# Altium schematic sheet mke04_heatGun.SchDoc
size A4
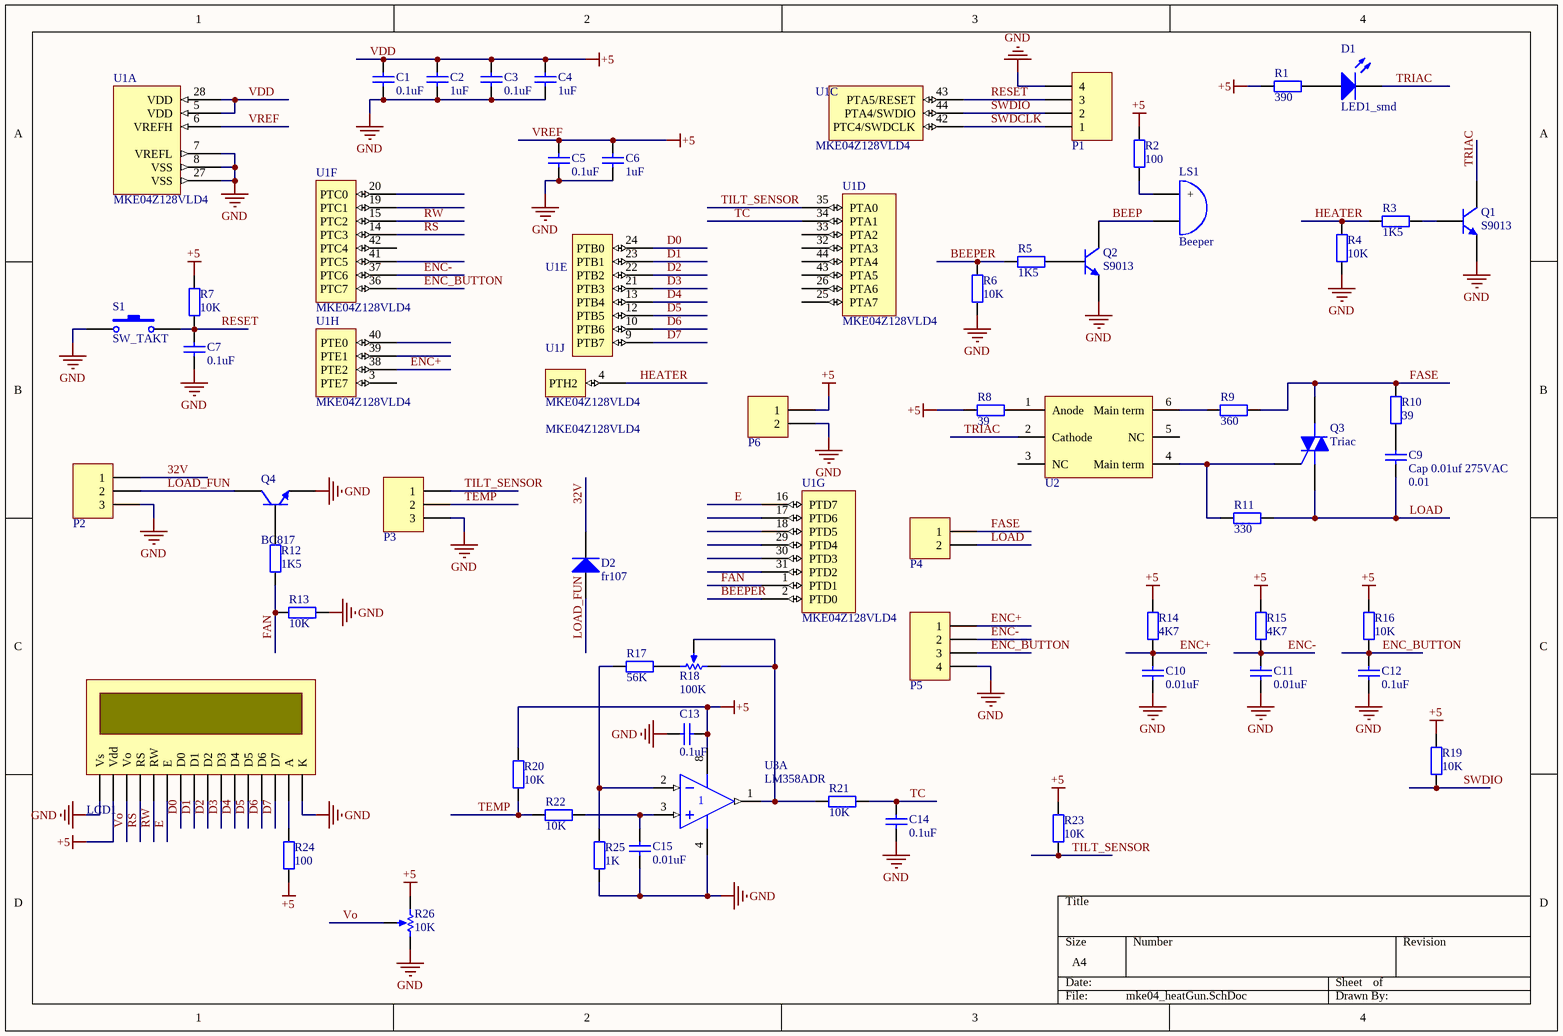
[diagram p0: mke04_heatGun.SchDoc]

## Parts
C1  value 0.1uF  [0805_C]  (hidden comment: Cap 0.1uf)
C2  value 1uF  [0805_C]  (hidden comment: Cap 1uf)
C3  value 0.1uF  [0805_C]  (hidden comment: Cap 0.1uf)
C4  value 1uF  [0805_C]  (hidden comment: Cap 1uf)
C5  value 0.1uF  [0805_C]  (hidden comment: Cap 0.1uf)
C6  value 1uF  [0805_C]  (hidden comment: Cap 1uf)
C7  value 0.1uF  [0805_C]  (hidden comment: Cap 0.1uf)
C9  Cap 0.01uf 275VAC  value 0.01  [CAPR1000-500X1300X1100]
C10  value 0.01uF  [0805_C]  (hidden comment: Cap 0.01uf)
C11  value 0.01uF  [0805_C]  (hidden comment: Cap 0.01uf)
C12  value 0.1uF  [0805_C]  (hidden comment: Cap 0.1uf)
C13  value 0.1uF  [0805_C]  (hidden comment: Cap 0.1uf)
C14  value 0.1uF  [0805_C]  (hidden comment: Cap 0.1uf)
C15  value 0.01uF  [0805_C]  (hidden comment: Cap 0.01uf)
D1  LED1_smd  [0805_R]
D2  fr107  [DO-41]
LCD1  LCD1602  [LCD1602]  (value not drawn)
LS1  Beeper  [Beeper]
P1  Pin header 4  [Pin_header_4P_2.54_M]  (value not drawn)
P2  Pin header 3  [PHOENIX_1715734]  (value not drawn)
P3  Pin header 3  [PHOENIX_1715734]  (value not drawn)
P4  Pin header 2  [PIN_HEADER_2_5.08]  (value not drawn)
P5  Pin header 4  [Pin_header_4P_2.54_M]  (value not drawn)
P6  Pin header 2  [PIN_HEADER_2_5.08]  (value not drawn)
Q1  S9013  [SOT23]
Q2  S9013  [SOT23]
Q3  Triac  [TO-220-v]
Q4  BC817  [SOT23]
R1  value 390  [0805_R]  (hidden comment: Res 390)
R2  value 100  [1206_R]  (hidden comment: Res 100)
R3  value 1K5  [0805_R]  (hidden comment: Res 1K5)
R4  value 10K  [0805_R]  (hidden comment: Res 10K)
R5  value 1K5  [0805_R]  (hidden comment: Res 1K5)
R6  value 10K  [0805_R]  (hidden comment: Res 10K)
R7  value 10K  [0805_R]  (hidden comment: Res 10K)
R8  value 39  [1206_R]  (hidden comment: Res 39)
R9  value 360  [2512_S]  (hidden comment: Res 360)
R10  value 39  [2512_S]  (hidden comment: Res 39)
R11  value 330  [2512_S]  (hidden comment: Res 330)
R12  value 1K5  [0805_R]  (hidden comment: Res 1K5)
R13  value 10K  [0805_R]  (hidden comment: Res 10K)
R14  value 4K7  [0805_R]  (hidden comment: Res 4K7)
R15  value 4K7  [0805_R]  (hidden comment: Res 4K7)
R16  value 10K  [0805_R]  (hidden comment: Res 10K)
R17  value 56K  [1206_R]  (hidden comment: Res 56K)
R18  value 100K  [TRIM_BOURNS_3266W]  (hidden comment: RPot_100k)
R19  value 10K  [0805_R]  (hidden comment: Res 10K)
R20  value 10K  [0805_R]  (hidden comment: Res 10K)
R21  value 10K  [0805_R]  (hidden comment: Res 10K)
R22  value 10K  [0805_R]  (hidden comment: Res 10K)
R23  value 10K  [0805_R]  (hidden comment: Res 10K)
R24  value 100  [1206_R]  (hidden comment: Res 100)
R25  value 1K  [1206_R]  (hidden comment: Res 1K)
R26  value 10K  [TRIM_BOURNS_3266W]  (hidden comment: RPot_10k)
S1  SW_TAKT  [TAKT-KEY]
U1  MKE04Z128VLD4  [QFP80P1390X1390X245-44N]  (parts A,C,D,E,F,G,H,J of 10)
U2  MOC3041  [DIP6-300]  (value not drawn)
U3  LM358ADR  [SOIC127_8]  (part A of 2)

## Nets
GND: C1.1 C2.1 C3.1 C4.1 C5.1 C6.1 C7.1 C10.1 C11.1 C12.1 C13.2 C14.2 C15.1 LCD1.1(Vs) LCD1.16(K) P1.4 P2.3 P3.3 P5.4 P6.2 Q1.2(E) Q2.2(E) Q4.2(E) R4.1 R6.1 R13.1 R25.1 R26.3(BOT) S1.1 U1.7(VREFL) U1.8(VSS) U1.27(VSS) U3.4(V-)
VDD: C1.2 C2.2 C3.2 C4.2 C5.2 C6.2 C13.1 LCD1.2(Vdd) P6.1 R1.2 R2.2 R7.2 R8.1 R14.2 R15.2 R16.2 R19.2 R20.1 R23.2 R24.1 R26.1(TOP) U1.5(VDD) U1.6(VREFH) U1.28(VDD) U3.8(V+)  [also labelled +5, VREF]
32V: D2.1(K) P2.1
BEEP: LS1.2(B) Q2.3(C)
BEEPER: R5.1 R6.2 U1.2(PTD0)
D0: LCD1.7(D0) U1.24(PTB0)
D1: LCD1.8(D1) U1.23(PTB1)
D2: LCD1.9(D2) U1.22(PTB2)
D3: LCD1.10(D3) U1.21(PTB3)
D4: LCD1.11(D4) U1.13(PTB4)
D5: LCD1.12(D5) U1.12(PTB5)
D6: LCD1.13(D6) U1.10(PTB6)
D7: LCD1.14(D7) U1.9(PTB7)
E: LCD1.6(E) U1.16(PTD7)
ENC+: C10.2 P5.1 R14.1 U1.38(PTE2)
ENC-: C11.2 P5.2 R15.1 U1.37(PTC6)
ENC_BUTTON: C12.2 P5.3 R16.1 U1.36(PTC7)
FAN: R12.1 R13.2 U1.1(PTD1)
FASE: P4.1 Q3.2(A2) R9.2 R10.2
HEATER: R3.1 R4.2 U1.4(PTH2)
LOAD: C9.1 P4.2 Q3.1(A1) R11.2
LOAD_FUN: D2.2(A) P2.2 Q4.3(C)
RESET: C7.2 P1.3 R7.1 S1.2 U1.43(PTA5/RESET)
RS: LCD1.4(RS) U1.14(PTC3)
RW: LCD1.5(RW) U1.15(PTC2)
SWDCLK: P1.1 U1.42(PTC4/SWDCLK)
SWDIO: P1.2 R19.1 U1.44(PTA4/SWDIO)
TC: C14.1 R21.1 U1.34(PTA1)
TEMP: P3.2 R20.2 R22.2
TILT_SENSOR: P3.1 R23.1 U1.35(PTA0)
TRIAC: D1.2(K) Q1.3(C) U2.2(Cathode)
Vo: LCD1.3(Vo) R26.2(TAP)
NetC9_2: C9.2 R10.1
NetC15_2: C15.2 R22.1 U3.3(IN+)
NetD1_1: D1.1(A) R1.1
NetLCD1_15: LCD1.15(A) R24.2
NetLS1_1: LS1.1(+) R2.1
NetQ1_1: Q1.1(B) R3.2
NetQ2_1: Q2.1(B) R5.2
NetQ3_3: Q3.3(G) R11.1 U2.4(Main_term)
NetQ4_1: Q4.1(B) R12.2
NetR8_2: R8.2 U2.1(Anode)
NetR9_1: R9.1 U2.6(Main_term)
NetR17_1: R17.1 R25.2 U3.2(IN-)
NetR17_2: R17.2 R18.3(BOT)
NetR18_1: R18.1(TOP) R18.2(TAP) R21.2 U3.1(OUT)

Not connected (* = marked no-connect by the designer): U1 3(PTE7) 17(PTD6) 18(PTD5) 19(PTC1) 20(PTC0) 25(PTA7) 26(PTA6) 29(PTD4) 30(PTD3) 31(PTD2) 32(PTA3) 33(PTA2) 39(PTE1) 40(PTE0) 41(PTC5); U2 3(NC) 5(NC)

## Library data of the parts
C9 = Cap 0.01uf 275VAC: Capacitor; Published: 8-Jun-2000; LatestRevisionDate: 17-Jul-2002; LatestRevisionNote: Re-released for DXP Platform.; PackageReference: RAD-0.3; Publisher: Altium Limited; PackageDescription: Radial Cap, Thru-Hole; 2 Leads; 0.3 in Pin Spacing
D1 = LED1_smd: Typical RED GaAs LED; Published: 8-Jun-2000; LatestRevisionDate: 08-Jul-2005; LatestRevisionNote: Mech Layer 1 removed.; PackageReference: LED-1; Publisher: Altium Limited; PackageDescription: LED; 2 Leads
D2 = fr107: 1 Amp Impulse diode; Published: 8-Jun-2000; LatestRevisionDate: 17-Jul-2002; LatestRevisionNote: Re-released for DXP Platform.; DatasheetVersion: 1998; PackageVersion: Aug-1999; PackageReference: DO-201AD; Publisher: Altium Limited; PackageDescription: Diode, Axial; Body 9.5 x 5.6 mm (LxDia. max), Lead Dia. 1.32 mm (max); ComponentLink1Description: Manufacturer Link; ComponentLink1URL: http://www.fairchildsemi.com/; ComponentLink2Description: Datasheet; ComponentLink2URL: http://www.fairchildsemi.com/ds/1N%2F1N5400.pdf
LCD1 = LCD1602: Display; Published: 24-Mar-1999; LatestRevisionDate: 29-May-2009; LatestRevisionNote: IPC-7351 Footprint Added.; PackageReference: D2PAK; Publisher: Altium Limited; PackageDescription: 3-Pin Transistor Outline Package 2.54 mm Pitch, 15.1 mm Lead Span
LS1 = Beeper: Electrical Bell; Published: 24-Mar-1999; LatestRevisionDate: 17-Jul-2002; LatestRevisionNote: Re-released for DXP Platform.; PackageReference: PIN2; Publisher: Altium Limited
Q1 Q2 = S9013: NPN transistor; Published: 8-Jun-2000; LatestRevisionDate: 15-Jan-2003; LatestRevisionNote: PCB Footprint 'BCY-W3/D4.7' replaced; DatasheetVersion: 1997; PackageVersion: Sep-1998; PackageReference: TO-92A; Publisher: Altium Limited; PackageDescription: TO, Flat Index; 3 In-Line, Axial Leads; Body Dia. 4.5mm; Leads 0.51 x 0.48 mm (max); ComponentLink1Description: Manufacturer Link; ComponentLink1URL: http://www.fairchildsemi.com/; ComponentLink2Description: Datasheet; ComponentLink2URL: http://www.fairchildsemi.com/ds/2N%2F2N3904.pdf
Q3 = Triac: Silicon Bidirectional Triode Thyristor; Note: Pin 2 is electrically connected to Pin 4 (TAB); Published: 29-Sep-2000; LatestRevisionDate: 17-Jul-2002; LatestRevisionNote: Re-released for DXP Platform.; DatasheetVersion: 1999; PackageReference: 369-03; Publisher: Altium Limited; PackageDescription: TO, Thru-Hole, Vertical, Heatsink Mounted; 3 In-Line Leads; Pitch 2.28 mm; ComponentLink1Description: Manufacturer Link; ComponentLink1URL: http://www.motorola.com/
Q4 = BC817: NPN Bipolar Transistor; Published: 8-Jun-2000; LatestRevisionDate: 17-Jul-2002; LatestRevisionNote: Re-released for DXP Platform.; PackageReference: TO-226-AA; Publisher: Altium Limited; PackageDescription: TO, Flat Index; 3 In-Line, Axial Leads; Body Dia. 4.8mm; Leads 0.55 x 0.51 mm (max); Code_JEDEC: TO-226-AA
R1 = Res 390: Resistor; Published: 8-Jun-2000; LatestRevisionDate: 17-Jul-2002; LatestRevisionNote: Re-released for DXP Platform.; PackageReference: AXIAL-0.4; Publisher: Altium Limited; PackageDescription: Axial Device, Thru-Hole; 2 Leads; 0.4 in Pin Spacing
R2 R24 = Res 100: Resistor; Published: 8-Jun-2000; LatestRevisionDate: 17-Jul-2002; LatestRevisionNote: Re-released for DXP Platform.; PackageReference: AXIAL-0.4; Publisher: Altium Limited; PackageDescription: Axial Device, Thru-Hole; 2 Leads; 0.4 in Pin Spacing
R3 R5 R12 = Res 1K5: Resistor; Published: 8-Jun-2000; LatestRevisionDate: 17-Jul-2002; LatestRevisionNote: Re-released for DXP Platform.; PackageReference: AXIAL-0.4; Publisher: Altium Limited; PackageDescription: Axial Device, Thru-Hole; 2 Leads; 0.4 in Pin Spacing
R4 R6 R7 R13 R16 R19-R23 = Res 10K: Resistor; Published: 8-Jun-2000; LatestRevisionDate: 17-Jul-2002; LatestRevisionNote: Re-released for DXP Platform.; PackageReference: AXIAL-0.4; Publisher: Altium Limited; PackageDescription: Axial Device, Thru-Hole; 2 Leads; 0.4 in Pin Spacing
R8 R10 = Res 39: Resistor; Published: 8-Jun-2000; LatestRevisionDate: 17-Jul-2002; LatestRevisionNote: Re-released for DXP Platform.; PackageReference: AXIAL-0.4; Publisher: Altium Limited; PackageDescription: Axial Device, Thru-Hole; 2 Leads; 0.4 in Pin Spacing
R9 = Res 360: Resistor; Published: 8-Jun-2000; LatestRevisionDate: 17-Jul-2002; LatestRevisionNote: Re-released for DXP Platform.; PackageReference: AXIAL-0.4; Publisher: Altium Limited; PackageDescription: Axial Device, Thru-Hole; 2 Leads; 0.4 in Pin Spacing
R11 = Res 330: Resistor; Published: 8-Jun-2000; LatestRevisionDate: 17-Jul-2002; LatestRevisionNote: Re-released for DXP Platform.; PackageReference: AXIAL-0.4; Publisher: Altium Limited; PackageDescription: Axial Device, Thru-Hole; 2 Leads; 0.4 in Pin Spacing
R14 R15 = Res 4K7: Resistor; Published: 8-Jun-2000; LatestRevisionDate: 17-Jul-2002; LatestRevisionNote: Re-released for DXP Platform.; PackageReference: AXIAL-0.4; Publisher: Altium Limited; PackageDescription: Axial Device, Thru-Hole; 2 Leads; 0.4 in Pin Spacing
R17 = Res 56K: Resistor; Published: 8-Jun-2000; LatestRevisionDate: 17-Jul-2002; LatestRevisionNote: Re-released for DXP Platform.; PackageReference: AXIAL-0.4; Publisher: Altium Limited; PackageDescription: Axial Device, Thru-Hole; 2 Leads; 0.4 in Pin Spacing
R18 = RPot_100k: Potentiometer; Sim Note: Enter the Resistance value and the set point into parameter fields.; Set Position: 0.5; Published: 8-Jun-2000; LatestRevisionDate: 17-Jul-2002; LatestRevisionNote: Re-released for DXP Platform.; PackageReference: VR5; Publisher: Altium Limited; PackageDescription: Variable Resistor, Thru-Hole; 3 Leads
R25 = Res 1K: Resistor; Published: 8-Jun-2000; LatestRevisionDate: 17-Jul-2002; LatestRevisionNote: Re-released for DXP Platform.; PackageReference: AXIAL-0.4; Publisher: Altium Limited; PackageDescription: Axial Device, Thru-Hole; 2 Leads; 0.4 in Pin Spacing
R26 = RPot_10k: Potentiometer; Sim Note: Enter the Resistance value and the set point into parameter fields.; Set Position: 0.5; Published: 8-Jun-2000; LatestRevisionDate: 17-Jul-2002; LatestRevisionNote: Re-released for DXP Platform.; PackageReference: VR5; Publisher: Altium Limited; PackageDescription: Variable Resistor, Thru-Hole; 3 Leads
U2 = MOC3041: MOC; Published: 8-Jun-2000; LatestRevisionDate: 29-May-2009; LatestRevisionNote: IPC-7351 Footprint Added.; PackageVersion: May-1999; PackageReference: DB008; Publisher: Altium Limited; PackageDescription: 8-Pin Plastic Small Outline Package 0.65 mm Pitch; Code_JEDEC: MO-150-AA; Code_IPC: SOP65P780-8
U3 = LM358ADR: Dual Operational Amplifier; Published: 15-Apr-2002; LatestRevisionDate: 13-Apr-2006; LatestRevisionNote: IPC-7351 Footprint Added.; DatasheetVersion: Aug-1988; PackageVersion: Jan-1998; PackageReference: D008; Publisher: Altium Limited; PackageDescription: 8-Pin Small Outline Integrated Circuit 1.27 mm Pitch; Code_IPC: SOIC127P600-8; ComponentLink1Description: Manufacturer Link; ComponentLink1URL: http://www.ti.com/; ComponentLink2Description: Datasheet; ComponentLink2URL: http://www-s.ti.com/sc/ds/lm358.pdf
C1 C3 C5 C7 C12-C14 = Cap 0.1uf: Published: 8-Jun-2000; LatestRevisionDate: 17-Jul-2002; LatestRevisionNote: Re-released for DXP Platform.; PackageReference: RB7.6-15; Publisher: Altium Limited; PackageDescription: Polarized Capacitor (Radial); 2 Leads
C2 C4 C6 = Cap 1uf: Published: 8-Jun-2000; LatestRevisionDate: 17-Jul-2002; LatestRevisionNote: Re-released for DXP Platform.; PackageReference: RB7.6-15; Publisher: Altium Limited; PackageDescription: Polarized Capacitor (Radial); 2 Leads
C10 C11 C15 = Cap 0.01uf: Published: 8-Jun-2000; LatestRevisionDate: 17-Jul-2002; LatestRevisionNote: Re-released for DXP Platform.; PackageReference: RB7.6-15; Publisher: Altium Limited; PackageDescription: Polarized Capacitor (Radial); 2 Leads
P1 P5 = Pin header 4: Published: 24-Mar-1999; LatestRevisionDate: 29-May-2009; LatestRevisionNote: IPC-7351 Footprint Added.; PackageReference: D2PAK; Publisher: Altium Limited; PackageDescription: 3-Pin Transistor Outline Package 2.54 mm Pitch, 15.1 mm Lead Span
P2 P3 = Pin header 3: Published: 24-Mar-1999; LatestRevisionDate: 29-May-2009; LatestRevisionNote: IPC-7351 Footprint Added.; PackageReference: D2PAK; Publisher: Altium Limited; PackageDescription: 3-Pin Transistor Outline Package 2.54 mm Pitch, 15.1 mm Lead Span
P4 P6 = Pin header 2: Published: 24-Mar-1999; LatestRevisionDate: 29-May-2009; LatestRevisionNote: IPC-7351 Footprint Added.; PackageReference: D2PAK; Publisher: Altium Limited; PackageDescription: 3-Pin Transistor Outline Package 2.54 mm Pitch, 15.1 mm Lead Span